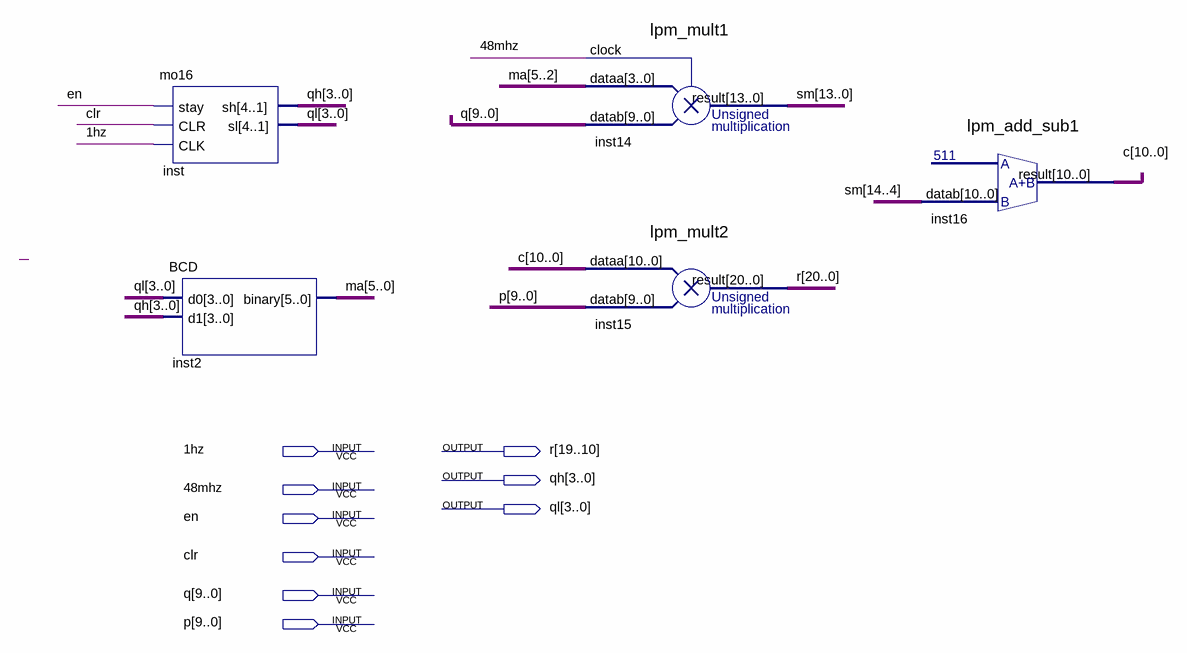
[diagram p0: schematic sheet]
// Quartus schematic AM.bdf as structural Verilog: 5 symbols, 9 pins
module AM (
  input  \1hz ,
  input  \48mhz ,
  input  en,
  input  clr,
  input  [9:0] q,
  input  [9:0] p,
  output [20:0] r,
  output [3:0] qh,
  output [3:0] ql
);

  wire [5:0] ma;
  wire [10:0] c;
  wire [14:0] sm;

  mo16 inst (.stay(en), .CLR(clr), .CLK(\1hz ), .sh(qh), .sl(ql));
  BCD inst2 (.d0(ql), .d1(qh), .binary(ma));
  lpm_mult1 inst14 (.dataa(ma[5:2]), .datab(q), .clock(\48mhz ), .result(sm[13:0]));
  lpm_mult2 inst15 (.dataa(c), .datab(p), .result(r));
  lpm_add_sub1 inst16 (.datab(sm[14:4]), .result(c));
endmodule
